# EAGLE schematic qc (EAGLE 9.2.2)

## Sheet 1 of 3
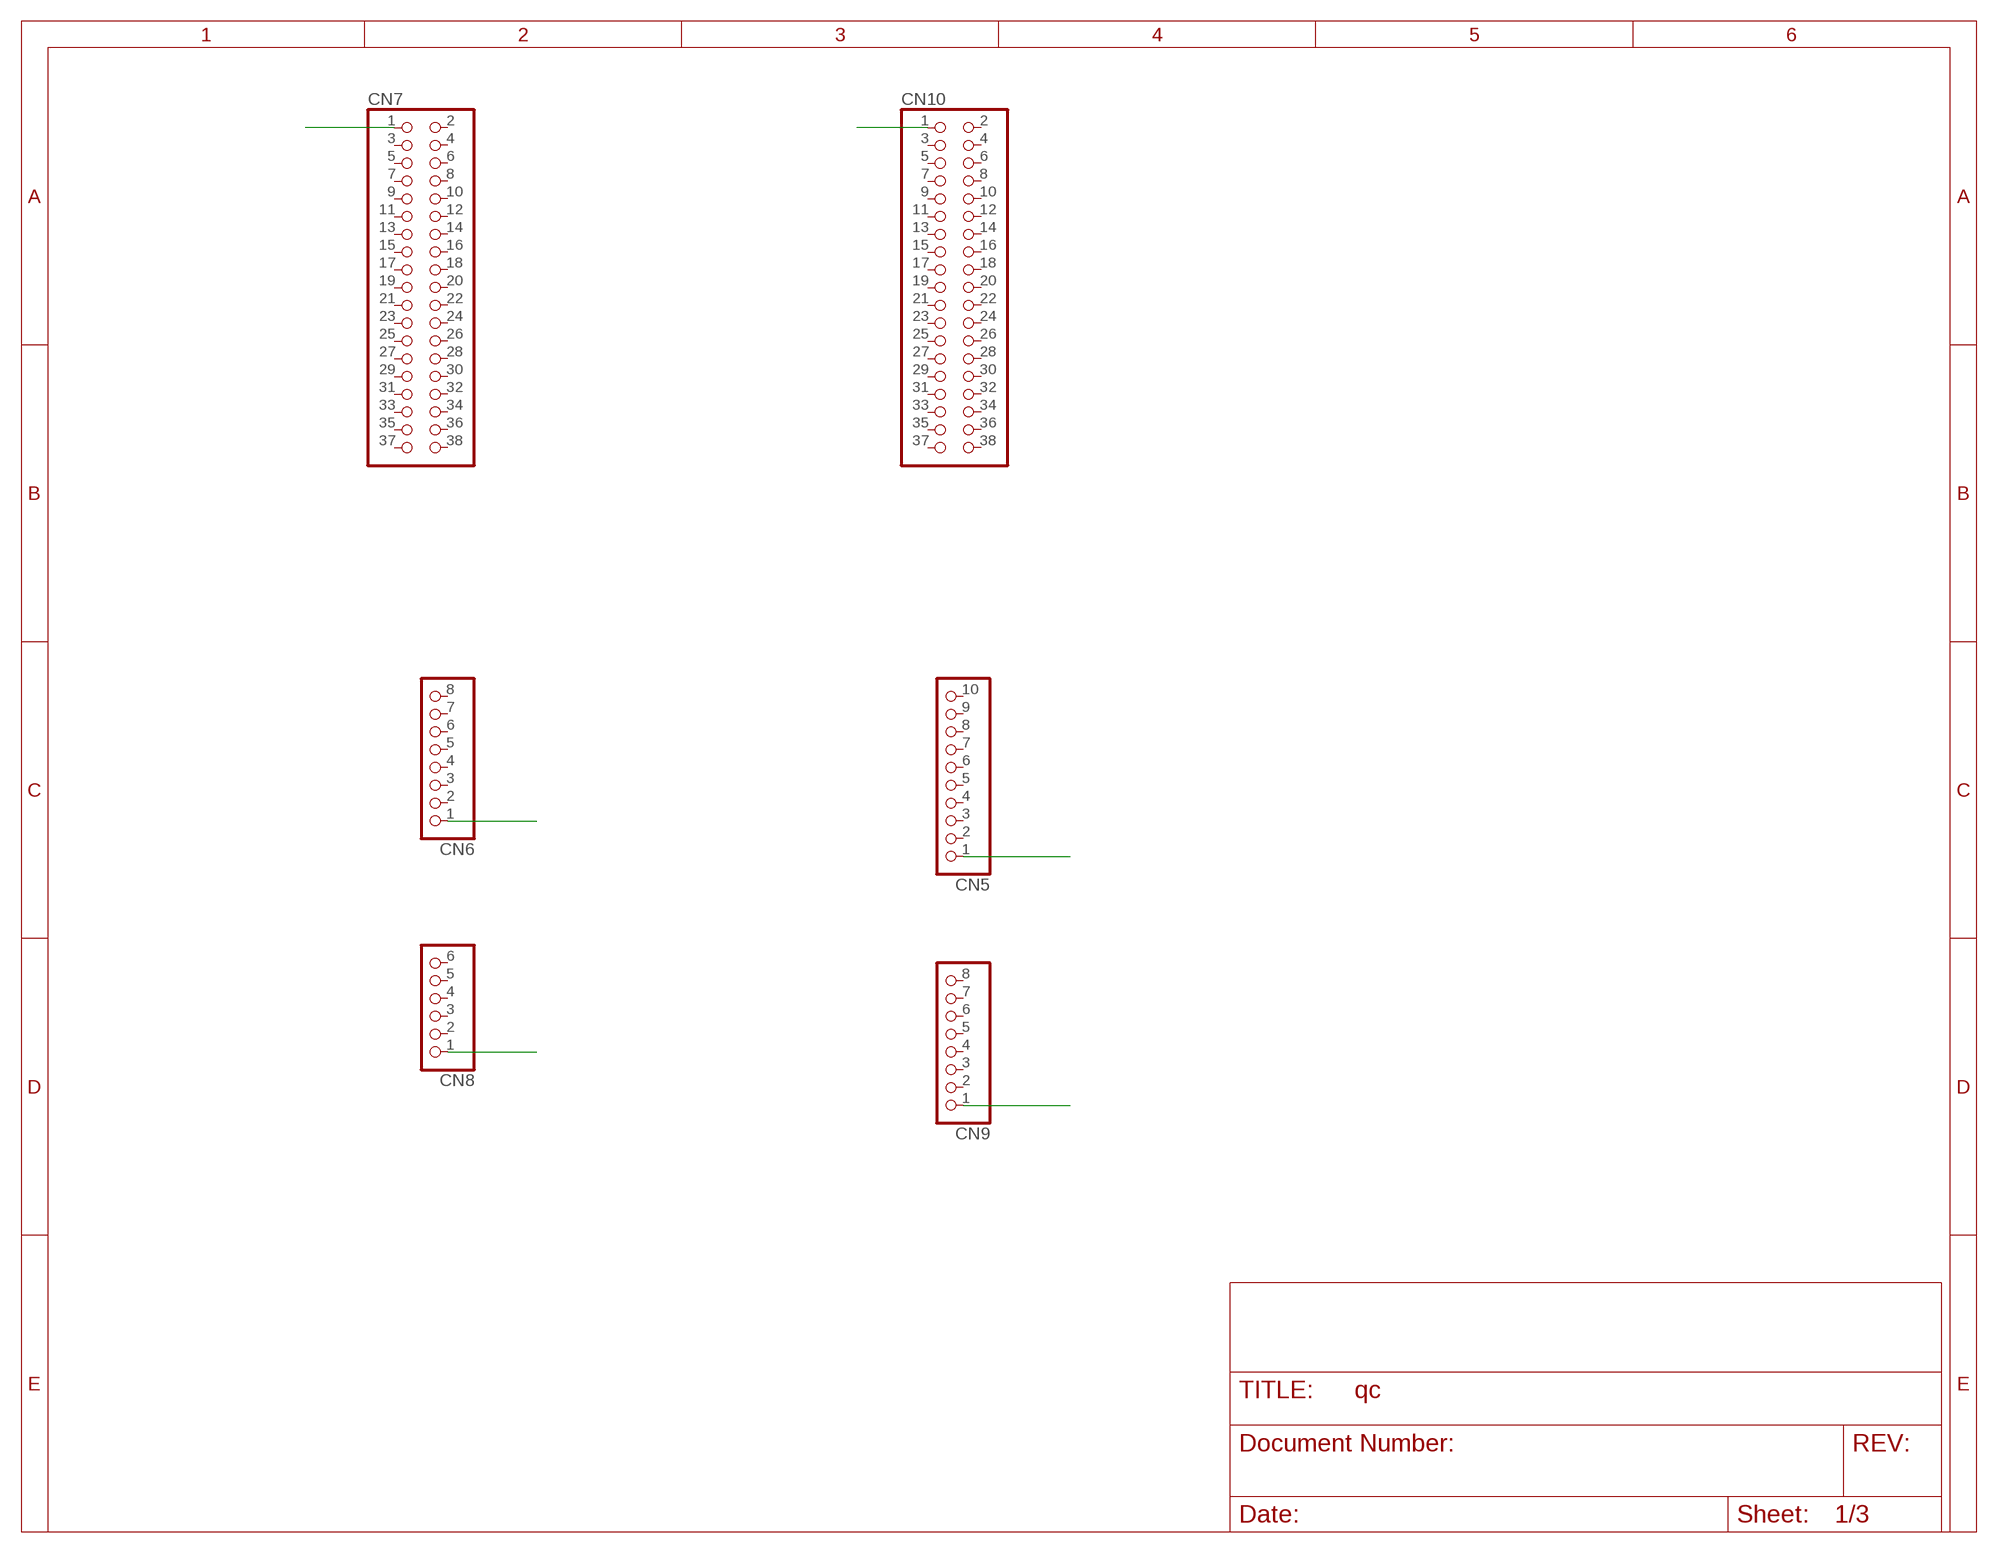
[diagram p0: schematic, sheet 1]

### Parts
CN5  PINHD-1X10  [1X10]
CN6  PINHD-1X8  [1X08]
CN7  PINHD-2X19  [2X19]
CN8  PINHD-1X6  [1X06]
CN9  PINHD-1X8  [1X08]
CN10  PINHD-2X19  [2X19]

### Nets
N$1: CN7.1
N$2: CN10.1
N$3: CN5.1
N$4: CN9.1
N$5: CN6.1
N$6: CN8.1
Unconnected: CN5.2 CN5.3 CN5.4 CN5.5 CN5.6 CN5.7 CN5.8 CN5.9 CN5.10 CN6.2 CN6.3 CN6.4 CN6.5 CN6.6 CN6.7 CN6.8 CN7.2 CN7.3 CN7.4 CN7.5 CN7.6 CN7.7 CN7.8 CN7.9 CN7.10 CN7.11 CN7.12 CN7.13 CN7.14 CN7.15 CN7.16 CN7.17 CN7.18 CN7.19 CN7.20 CN7.21 CN7.22 CN7.23 CN7.24 CN7.25 CN7.26 CN7.27 CN7.28 CN7.29 CN7.30 CN7.31 CN7.32 CN7.33 CN7.34 CN7.35 CN7.36 CN7.37 CN7.38 CN8.2 CN8.3 CN8.4 CN8.5 CN8.6 CN9.2 CN9.3 CN9.4 CN9.5 CN9.6 CN9.7 CN9.8 CN10.2 CN10.3 CN10.4 CN10.5 CN10.6 CN10.7 CN10.8 CN10.9 CN10.10 CN10.11 CN10.12 CN10.13 CN10.14 CN10.15 CN10.16 CN10.17 CN10.18 CN10.19 CN10.20 CN10.21 CN10.22 CN10.23 CN10.24 CN10.25 CN10.26 CN10.27 CN10.28 CN10.29 CN10.30 CN10.31 CN10.32 CN10.33 CN10.34 CN10.35 CN10.36 CN10.37 CN10.38

## Sheet 2 of 3
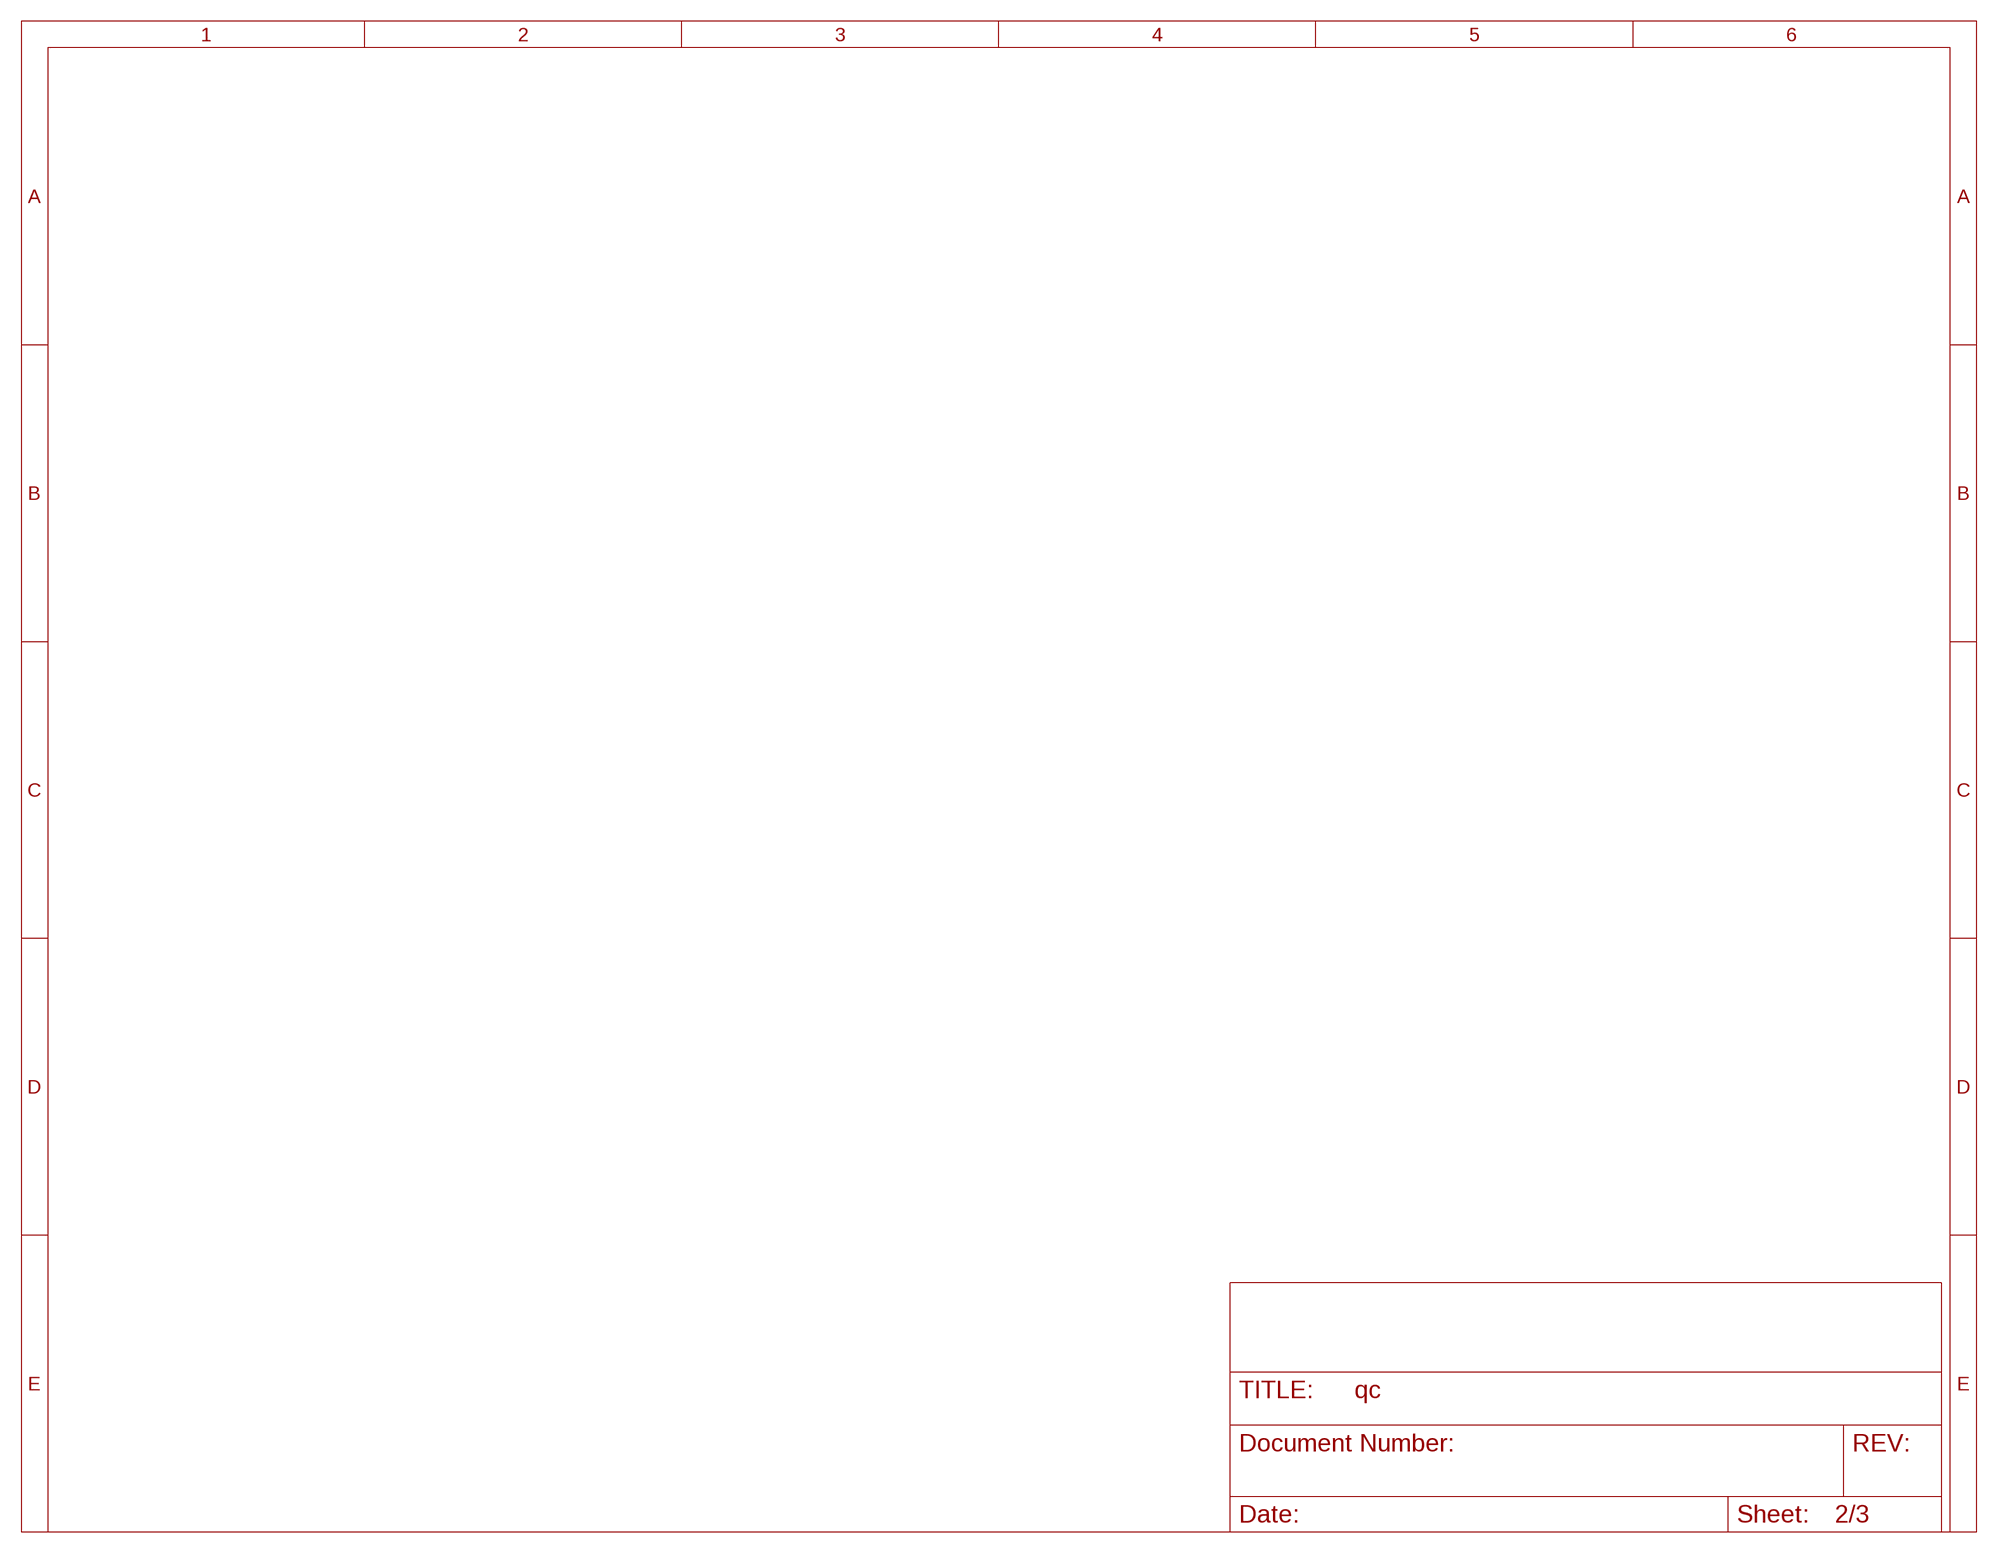
[diagram p1: schematic, sheet 2]

## Sheet 3 of 3
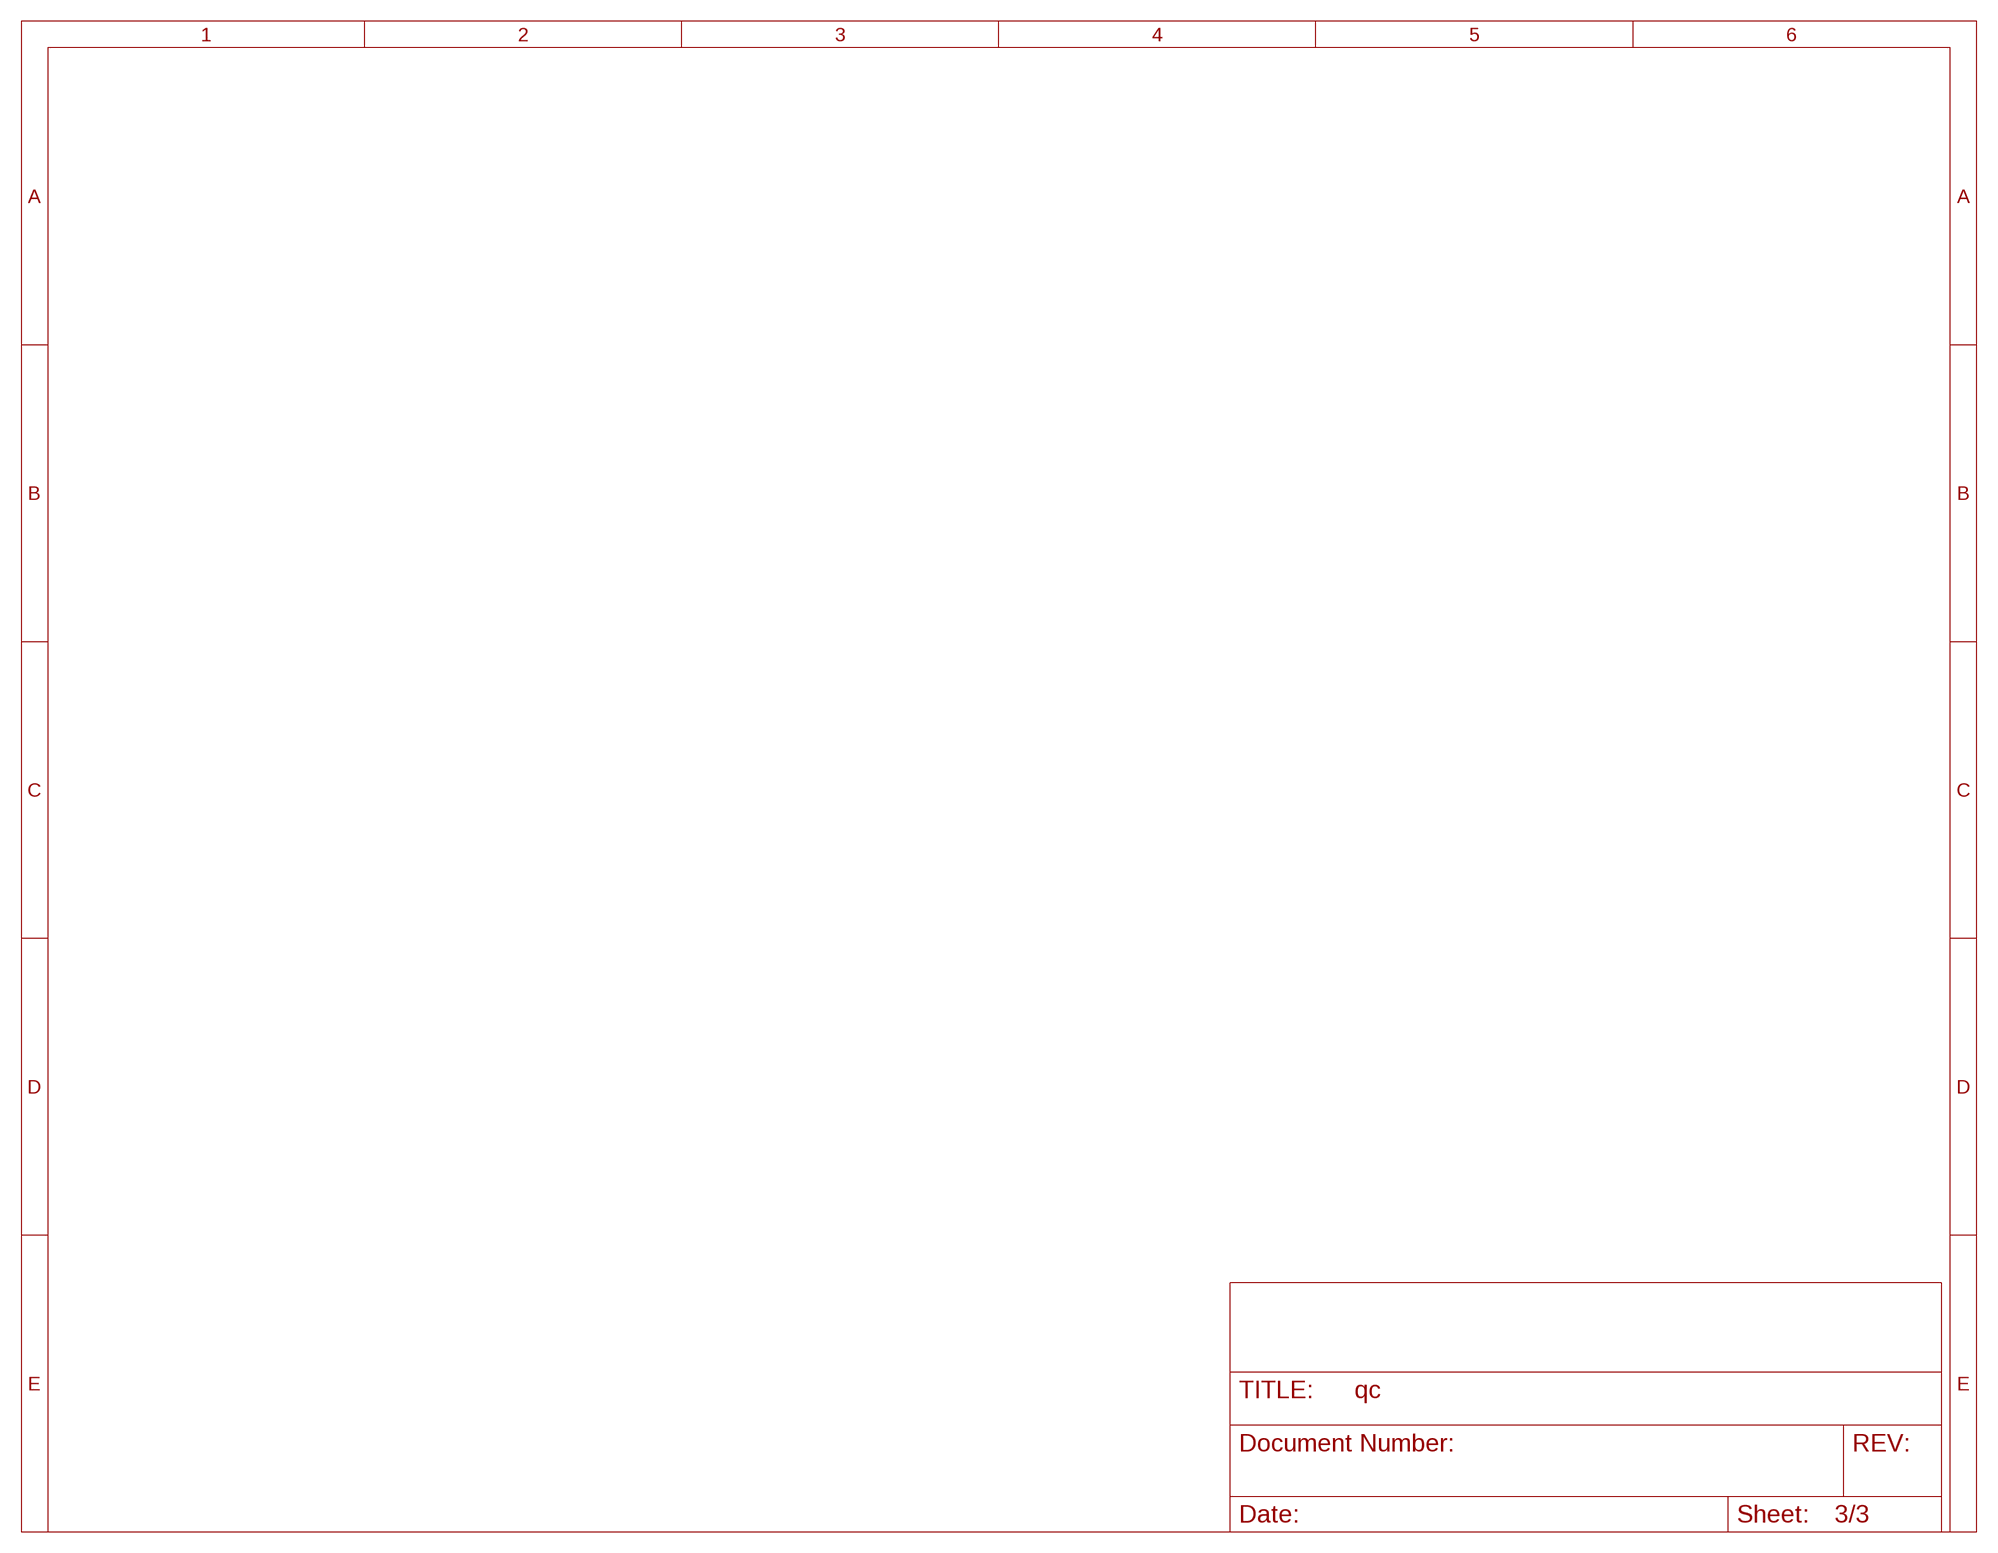
[diagram p2: schematic, sheet 3]

## Library data of the parts
CN5 = pinhead:PINHD-1X10: PIN HEADER
CN6 CN9 = pinhead:PINHD-1X8: PIN HEADER
CN7 CN10 = pinhead:PINHD-2X19: PIN HEADER
CN8 = pinhead:PINHD-1X6: PIN HEADER